# Altium project Fruit_Box_LED.PrjPcb
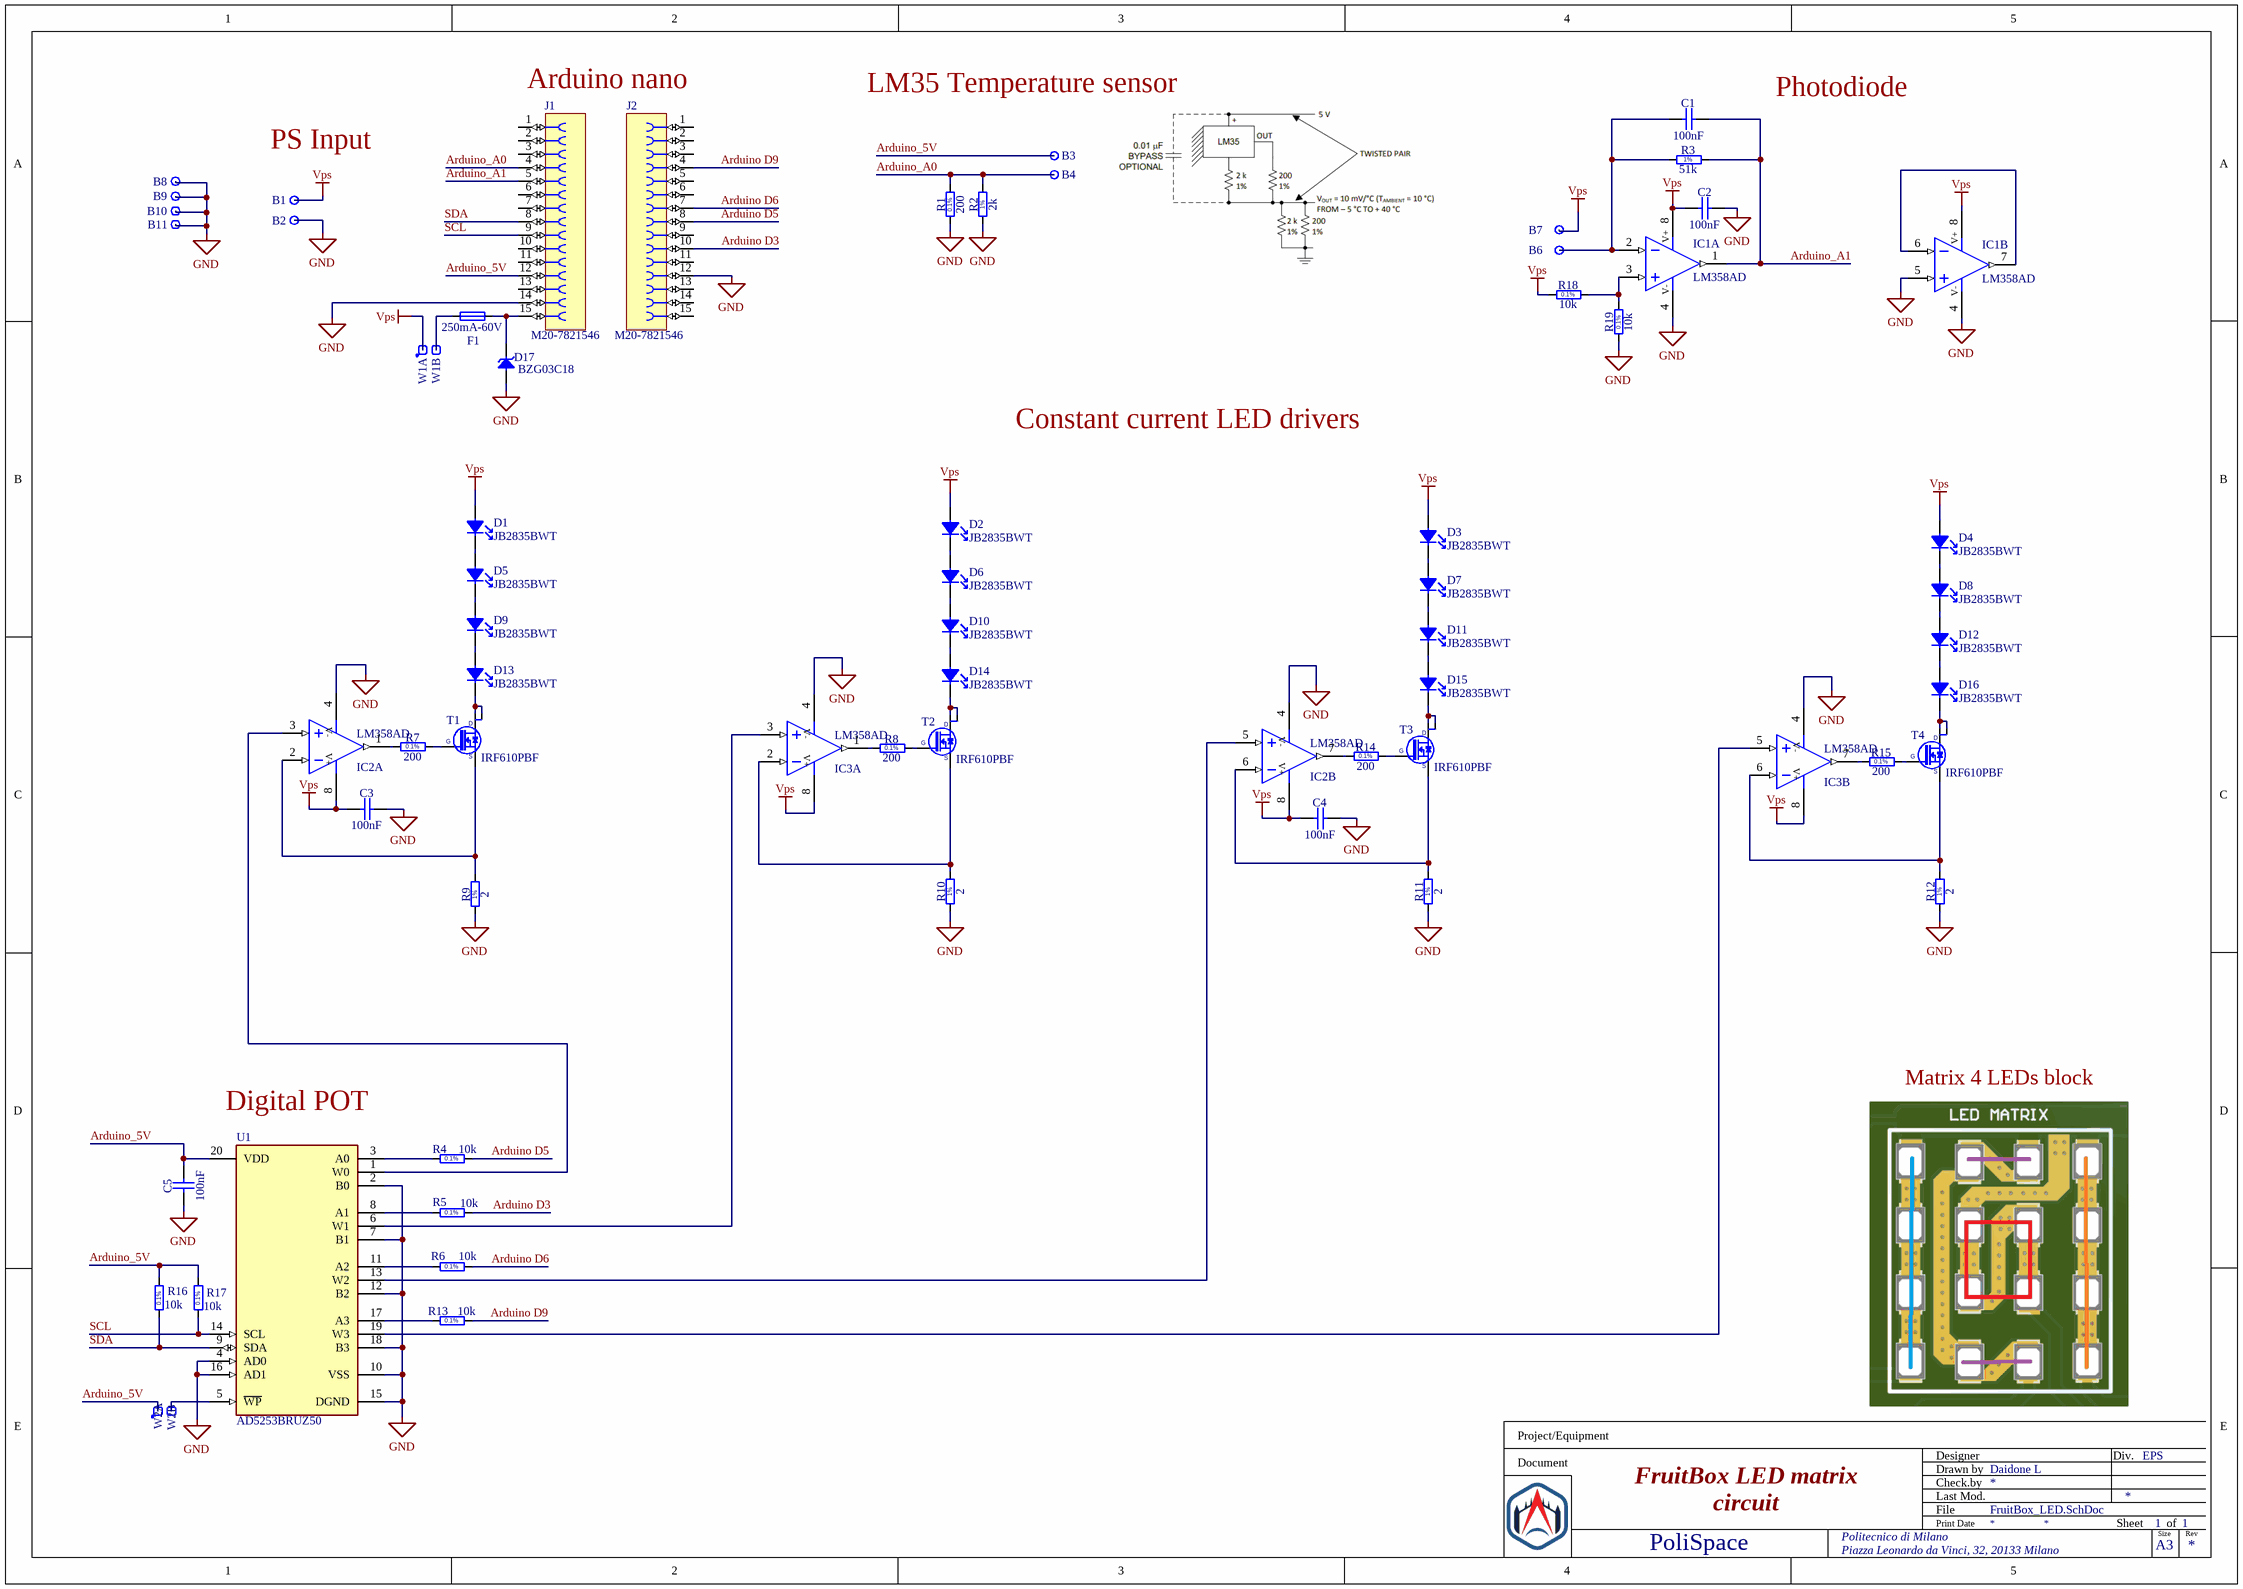
[diagram p0: FruitBox_LED.SchDoc]
CAGE_CODE: ?????; CONTRACT_NUMBER: <CONTRACT NO>; DOC_NO_ASSY_DWG: <ASSY DWG NO>; DOC_NO_BOM: <BOM DOC NO>; DOC_NO_FAB_DWG: <FAB DWG NO>; DOC_NO_SCH_DWG: <SCH DWG NO>; PCB_2_DEC_TOL: +/-.01; PCB_3_DEC_TOL: +/-.010; PCB_ANG_TOL: +/-1/2; PCB_ASSEMBLY_NO: <PCB ASSY NO>; PCB_CHECKER: - -----; PCB_CHECKER_APP_DATE: --/--/----; PCB_DESIGNER: - -----; PCB_DESIGNER_APP_DATE: --/--/----; PCB_DWG_NO: <PCB DWG NO>; PCB_ENGINEER: - -----; PCB_ENGINEER_APP_DATE: --/--/----; PCB_PART_NUMBER: <PCB PN>; PCB_REV: A; SCH_REV: A
1 sheet, 64 parts. Net scope: global (net labels, ports and power ports of the same name join across sheets).
Board file: FruitBox_LED.PcbDoc

## Sheet FruitBox_LED.SchDoc: FruitBox LED matrix
size 420 x 297 mm; DrawnBy: Daidone L; SheetNumber: 1; SheetTotal: 1; Title2: circuit; Project: 6S CubeSat; ENG_APP_DATE: --/--/--; DSN_APP_DATE: --/--/--; CHK_APP_DATE: --/--/--

### Parts
B1  Banana  [CINCH_105-2202-201]  (value not drawn)
B2  Banana  [CINCH_105-2203-201]  (value not drawn)
B3  Plated Hole  [c130h80]  (value not drawn)  (no BOM)
B4  Plated Hole  [c130h80]  (value not drawn)  (no BOM)
B6  Plated Hole  [c130h80]  (value not drawn)  (no BOM)
B7  Plated Hole  [c130h80]  (value not drawn)  (no BOM)
B8  Plated Hole  [MTG320_550]  (value not drawn)  (no BOM)
B9  Plated Hole  [MTG320_550]  (value not drawn)  (no BOM)
B10  Plated Hole  [MTG320_550]  (value not drawn)  (no BOM)
B11  Plated Hole  [MTG320_550]  (value not drawn)  (no BOM)
C1  100nF  [CAPC1608X87N]
C2  100nF  [CAPC1608X87N]
C3  100nF  [CAPC1608X87N]
C4  100nF  [CAPC1608X87N]
C5  100nF  [CAPC1608X87N]
D1  JB2835BWT  [JB2835BWT]
D2  JB2835BWT  [JB2835BWT]
D3  JB2835BWT  [JB2835BWT]
D4  JB2835BWT  [JB2835BWT]
D5  JB2835BWT  [JB2835BWT]
D6  JB2835BWT  [JB2835BWT]
D7  JB2835BWT  [JB2835BWT]
D8  JB2835BWT  [JB2835BWT]
D9  JB2835BWT  [JB2835BWT]
D10  JB2835BWT  [JB2835BWT]
D11  JB2835BWT  [JB2835BWT]
D12  JB2835BWT  [JB2835BWT]
D13  JB2835BWT  [JB2835BWT]
D14  JB2835BWT  [JB2835BWT]
D15  JB2835BWT  [JB2835BWT]
D16  JB2835BWT  [JB2835BWT]
D17  BZG03C18  [DIOM5326X230N]
F1  250mA-60V  [FUSR_BEL_0ZCJ0010FF2E]
IC1  LM358AD  [SOIC127P600X175-8N]  (parts A,B of 2)
IC2  LM358AD  [SOIC127P600X175-8N]  (parts A,B of 2)
IC3  LM358AD  [SOIC127P600X175-8N]  (parts A,B of 2)
J1  M20-7821546  [M20-7821546]
J2  M20-7821546  [M20-7821546]
R1  200  [RESC1608X64N]
R2  2k  [RESC1608X55N]
R3  51k  [RESC2012X60N]
R4  10k  [RESC1608X64N]
R5  10k  [RESC1608X64N]
R6  10k  [RESC1608X64N]
R7  200  [RESC1608X64N]
R8  200  [RESC1608X64N]
R9  2  [RES1016-630X250]
R10  2  [RES1016-630X250]
R11  2  [RES1016-630X250]
R12  2  [RES1016-630X250]
R13  10k  [RESC1608X64N]
R14  200  [RESC1608X64N]
R15  200  [RESC1608X64N]
R16  10k  [RESC1608X64N]
R17  10k  [RESC1608X64N]
R18  10k  [RESC1608X64N]
R19  10k  [RESC1608X64N]
T1  IRF610PBF  [TO-220-H]
T2  IRF610PBF  [TO-220-H]
T3  IRF610PBF  [TO-220-H]
T4  IRF610PBF  [TO-220-H]
U1  AD5253BRUZ50  [FP-RU-20-IPC_C]
W1  Header 2  [HARWIN_M20-9990246]  (value not drawn)  (parts A,B of 2)
W2  Header 2  [HARWIN_M20-9990246]  (value not drawn)  (parts A,B of 2)

### Nets
GND: B2.1 B8.1 B9.1 B10.1 B11.1 C2.2 C3.2 C4.2 C5.2 D17.2(A) IC1.4(V-) IC1.5(IN+) IC2.4(V-) IC3.4(V-) J1.14 J2.12 R1.1 R2.1 R9.1 R10.1 R11.1 R12.1 R19.1 U1.2(B0) U1.4(AD0) U1.7(B1) U1.10(VSS) U1.12(B2) U1.15(DGND) U1.16(AD1) U1.18(B3)
Vps: B1.1 B7.1 C2.1 C3.1 C4.1 D1.2(A) D2.2(A) D3.2(A) D4.2(A) IC1.8(V+) IC2.8(V+) IC3.8(V+) R18.1 W1.1
Arduino D3: J2.10 R5.1
Arduino D5: J2.8 R4.1
Arduino D6: J2.7 R6.1
Arduino D9: J2.4 R13.1
Arduino_5V: B3.1 C5.1 J1.12 R16.2 R17.2 U1.20(VDD) W2.1
Arduino_A0: B4.1 J1.4 R1.2 R2.2
Arduino_A1: C1.2 IC1.1(OUT) J1.5 R3.2
SCL: J1.9 R17.1 U1.14(SCL)
SDA: J1.8 R16.1 U1.9(SDA)
NetB6_1: B6.1 C1.1 IC1.2(IN-) R3.1
NetD1_1: D1.1(C) D5.2(A)
NetD2_1: D2.1(C) D6.2(A)
NetD3_1: D3.1(C) D7.2(A)
NetD4_1: D4.1(C) D8.2(A)
NetD5_1: D5.1(C) D9.2(A)
NetD6_1: D6.1(C) D10.2(A)
NetD7_1: D7.1(C) D11.2(A)
NetD8_1: D8.1(C) D12.2(A)
NetD9_1: D9.1(C) D13.2(A)
NetD10_1: D10.1(C) D14.2(A)
NetD11_1: D11.1(C) D15.2(A)
NetD12_1: D12.1(C) D16.2(A)
NetD13_1: D13.1(C) T1.2(D) T1.4(D)
NetD14_1: D14.1(C) T2.2(D) T2.4(D)
NetD15_1: D15.1(C) T3.2(D) T3.4(D)
NetD16_1: D16.1(C) T4.2(D) T4.4(D)
NetD17_1: D17.1(C) F1.2 J1.15
NetF1_1: F1.1 W1.2
NetIC1_3: IC1.3(IN+) R18.2 R19.2
NetIC1_6: IC1.6(IN-) IC1.7(OUT)
NetIC2_1: IC2.1(OUT) R7.1
NetIC2_2: IC2.2(IN-) R9.2 T1.3(S)
NetIC2_3: IC2.3(IN+) U1.1(W0)
NetIC2_5: IC2.5(IN+) U1.13(W2)
NetIC2_6: IC2.6(IN-) R11.2 T3.3(S)
NetIC2_7: IC2.7(OUT) R14.1
NetIC3_1: IC3.1(OUT) R8.1
NetIC3_2: IC3.2(IN-) R10.2 T2.3(S)
NetIC3_3: IC3.3(IN+) U1.6(W1)
NetIC3_5: IC3.5(IN+) U1.19(W3)
NetIC3_6: IC3.6(IN-) R12.2 T4.3(S)
NetIC3_7: IC3.7(OUT) R15.1
NetR4_2: R4.2 U1.3(A0)
NetR5_2: R5.2 U1.8(A1)
NetR6_2: R6.2 U1.11(A2)
NetR7_2: R7.2 T1.1(G)
NetR8_2: R8.2 T2.1(G)
NetR13_2: R13.2 U1.17(A3)
NetR14_2: R14.2 T3.1(G)
NetR15_2: R15.2 T4.1(G)
NetU1_5: U1.5(~{WP}) W2.2

Not connected (* = marked no-connect by the designer): J1 1 2 3 6 7 10 11 13; J2 1 2 3 5 6 9 11 13 14 15

### Notes on the sheet
- Arduino nano
- LM35 Temperature sensor
- Photodiode
- PS Input
- Constant current LED drivers
- (near U1) Digital POT
- Matrix 4 LEDs block
- Project/Equipment
- Document
- Designer
- Drawn by
- Check.by
- Div.
- EPS
- PoliSpace
- Politecnico di Milano
- File
- Last Mod.
- Print Date
- Sheet
- Size
- A3
- of
- Rev
- Piazza Leonardo da Vinci, 32, 20133 Milano
- (in symbol R0603_2K_1%_0.1W_100PPM) 1%
- (in symbol R0603_10K_0.1%_0.1W_25PPM) 0.1%
- (in symbol R0603_200R_0.1%_0.1W_25PPM) 0.1%
- (in symbol R0805_51K_1%_0.125W_100PPM) 1%
- (in symbol RMF_2R_1%_0.6W_50PPM_1016-630X250) 1%

### Library data of the parts
B1 = CINCH_105-2202-201: Single Terminal Socket; Part Description: Red Tip Jack, Vertical For Banana 2mm; Manufacturer: CINCH CONNECTIVITY; PressFit: No; Part Number: CINCH_105-2202-201; Component Kind: Standard; Component Type: Standard; Pin Count: 1; Family: Banana; Mounted: Yes; Socket: No; SMD: No; Sense: No; Status: None; Manufacturer Part Number: 105-2202-201; ComponentHeight: 8.26mm; HelpURL: \\cern.ch\dfs\Applications\Altium\Datasheets\CINCH_105-22XX-201.pdf; Author: CERN DEM MR; CreateDate: 23-Feb-16; LatestRevisionDate: 23-Feb-16
B2 = CINCH_105-2203-201: Single Terminal Socket; Part Description: Black Tip Jack, Vertical For Banana 2mm; Manufacturer: CINCH CONNECTIVITY; PressFit: No; Part Number: CINCH_105-2203-201; Component Kind: Standard; Component Type: Standard; Pin Count: 1; Family: Banana; Mounted: Yes; Socket: No; SMD: No; Sense: No; Status: None; Manufacturer Part Number: 105-2203-201; ComponentHeight: 8.26mm; HelpURL: \\cern.ch\dfs\Applications\Altium\Datasheets\CINCH_105-22XX-201.pdf; Author: CERN DEM MR; CreateDate: 23-Feb-16; LatestRevisionDate: 23-Feb-16
B3 B4 B6 B7 = PLATED_HOLE0.8_PAD1.3: Single Terminal Socket; Part Description: Plated Through Hole: Hole Dia.=0.8mm Pad Dia.=1.3mm, IPC-7251 Level C; Mounted: No; Part Number: PLATED_HOLE0.8_PAD1.3; Component Type: Standard (No BOM); Pin Count: 1; Family: Plated Hole; Socket: No; SMD: No; Sense: No; Status: None; ComponentHeight: 0mm; HelpURL: Undefined; Author: CERN DEM JLC; CreateDate: 30-Oct-08; LatestRevisionDate: 30-Oct-08; PackageDescription: Plated Through Hole: Hole Dia.=0.8mm Pad Dia.=1.3mm, IPC-7251 Level C
B8-B11 = PLATED_HOLE3.2_PAD5.5: Single Terminal Socket; Part Description: Plated Through Hole: Hole Dia.=3.2mm Pad Dia.=5.5mm; Mounted: No; Part Number: PLATED_HOLE3.2_PAD5.5; Component Type: Standard (No BOM); Pin Count: 1; Family: Plated Hole; Socket: No; SMD: No; Sense: No; Status: None; ComponentHeight: 0mm; HelpURL: Undefined; Author: CERN DEM JMW; CreateDate: 01-Oct-12; LatestRevisionDate: 01-Oct-12; PackageDescription: Plated Through Hole: Hole Dia.=3.2mm Pad Dia.=5.5mm
C1-C5 = CC0603_100NF_50V_10%_X7R: Non-polarised capacitor; Part Description: SMD Multilayer Chip Ceramic Capacitor; Manufacturer: GENERIC; Manufacturer1 Part Number: 223858615649; Voltage: 50V; TC: X7R; Tolerance: ±10%; Part Number: CC0603_100NF_50V_10%_X7R; Component Kind: Standard; Component Type: Standard; Pin Count: 2; Value: 100nF; Status: Preferred; Manufacturer Part Number: CC0603_100NF_50V_10%_X7R; Case: 0603; Mounted: Yes; Socket: No; SMD: Yes; Sense: No; Manufacturer1 Example: PHYCOMP; Manufacturer1 ComponentHeight: 0.87mm; HelpURL: \\cern.ch\dfs\Applications\Altium\Datasheets\CC0603_X7R_PHYCOMP.pdf; Author: CERN DEM JLC; CreateDate: 03-Dec-07; LatestRevisionDate: 03-Dec-07
D1-D16 = JB2835BWT-G-U35GA0000
D17 = BZG03C18: Zener Diode; Part Description: Voltage Regulator Diode; Manufacturer: VISHAY SEMICONDUCTORS; Voltage: 18V; Power: 1.25W; PressFit: No; Bonding: No; Part Number: BZG03C18; Component Kind: Standard; Component Type: Standard; Device: BZG03C18; PackageDescription: DO-214-AC/SMA Molded Diode, Body 5.3x2.6mm, IPC Medium Density; Manufacturer Part Number: BZG03C18; Pin Count: 2; Case: DO-214AC; Mounted: Yes; Socket: No; SMD: Yes; Sense: No; ComponentHeight: 2.3mm; HelpURL: \\cern.ch\dfs\Applications\Altium\Datasheets\BZG03C.pdf; Author: CERN DEM JLC; CreateDate: 02-Jun-08; LatestRevisionDate: 02-Jun-08
F1 = FUSR1206_BEL_0ZCJ0010FF2E: Fuse; Part Description: Surface Mount PTC Resettable Fuse,  OZCJ Series; Manufacturer: BEL; PressFit: No; Part Number: FUSR1206_BEL_0ZCJ0010FF2E; Component Kind: Standard; Component Type: Standard; Pin Count: 2; PackageDescription: 1206 (3216mm), Body 3.25 x 1.65mm, Surface Mount PTC Resettable Fuse,  OZCJ Series; Family: Fuses Resettable; Mounted: Yes; Socket: No; SMD: Yes; Sense: No; Value: 250mA-60V; Manufacturer Part Number: 0ZCJ0010FF2E; ComponentHeight: 0.85mm; HelpURL: \\cern.ch\dfs\Applications\Altium\Datasheets\FUSR_BEL_0ZCJ.pdf; Author: CERN DEM BR; CreateDate: 20-May-19; LatestRevisionDate: 20-May-19
IC1-IC3 = LM358AD: Dual Operational Amplifier; Manufacturer: TEXAS INSTRUMENTS; PressFit: No; Bonding: No; Part Number: LM358AD; Component Kind: Standard; Component Type: Standard; Device: LM358AD; PackageDescription: SOIC 8, Pitch 1.27mm - Body 4x5mm, IPC Medium Density; Part Description: Dual Operational Amplifier; Manufacturer Part Number: LM358AD; Pin Count: 8; Case: SOIC8; Mounted: Yes; Socket: No; SMD: Yes; Sense: No; ComponentHeight: 1.75mm; Author: CERN DEM JLC; HelpURL: \\cern.ch\dfs\Applications\Altium\Datasheets\LM358AD.pdf; CreateDate: 02-Dec-08; LatestRevisionDate: 13-Apr-10
R1 R7 R8 R14 R15 = R0603_200R_0.1%_0.1W_25PPM: Resistor - 0.1%; Part Description: Thin Film Chip Resistor; Manufacturer: GENERIC; Manufacturer1 Part Number: ERA3AEB201V; Power: 0.1W; TC: ±25ppm/°C; PressFit: No; Part Number: R0603_200R_0.1%_0.1W_25PPM; Component Kind: Standard; Component Type: Standard; Pin Count: 2; Value: 200; Status: Not Recommended; Tolerance: ±0.1%; Manufacturer Part Number: R0603_200R_0.1%_0.1W_25PPM; Case: 0603; Mounted: Yes; Sense: No; Socket: No; SMD: Yes; Manufacturer1 Example: PANASONIC; Manufacturer1 ComponentHeight: 0.55mm; HelpURL: \\cern.ch\dfs\Applications\Altium\Datasheets\R0603_PANASONIC_ERA.pdf; Author: CERN DEM JLC; CreateDate: 12-Jan-17; LatestRevisionDate: 12-Jan-17
R2 = R0603_2K_1%_0.1W_100PPM: Resistor - 1%; Part Description: General Purpose Thick Film Chip Resistor; Manufacturer: GENERIC; Manufacturer1 Part Number: NRC06F2001TRF; Power: 0.1W; TC: ±100ppm/°C; PressFit: No; Part Number: R0603_2K_1%_0.1W_100PPM; Component Kind: Standard; Component Type: Standard; Pin Count: 2; Value: 2k; Status: Preferred; Tolerance: ±1%; Manufacturer Part Number: R0603_2K_1%_0.1W_100PPM; Case: 0603; Mounted: Yes; Sense: No; Socket: No; SMD: Yes; Manufacturer1 Example: NIC COMPONENT; Manufacturer1 ComponentHeight: 0.55mm; HelpURL: \\cern.ch\dfs\Applications\Altium\Datasheets\R0603_NIC_NRC.pdf; Author: CERN DEM JLC; CreateDate: 03-Dec-07; LatestRevisionDate: 13-Mar-08
R3 = R0805_51K_1%_0.125W_100PPM: Resistor - 1%; Part Description: General Purpose Thick Film Chip Resistor; Manufacturer: GENERIC; Manufacturer1 Part Number: NRC10F5102TRF; Power: 0.125W; TC: ±100ppm/°C; PressFit: No; Part Number: R0805_51K_1%_0.125W_100PPM; Component Kind: Standard; Component Type: Standard; Pin Count: 2; Value: 51k; Status: Preferred; Tolerance: ±1%; Manufacturer Part Number: R0805_51K_1%_0.125W_100PPM; Case: 0805; Mounted: Yes; Sense: No; Socket: No; SMD: Yes; Manufacturer1 Example: NIC COMPONENT; Manufacturer1 ComponentHeight: 0.6mm; HelpURL: \\cern.ch\dfs\Applications\Altium\Datasheets\R0805_NIC_NRC.pdf; Author: CERN DEM JLC; CreateDate: 03-Dec-07; LatestRevisionDate: 13-Mar-08
R4-R6 R13 R16-R19 = R0603_10K_0.1%_0.1W_25PPM: Resistor - 0.1%; Part Description: Thin Film Chip Resistor; Manufacturer: GENERIC; Manufacturer1 Part Number: ERA3AEB103V; Power: 0.1W; TC: ±25ppm/°C; PressFit: No; Part Number: R0603_10K_0.1%_0.1W_25PPM; Component Kind: Standard; Component Type: Standard; Pin Count: 2; Value: 10k; Status: Not Recommended; Tolerance: ±0.1%; Manufacturer Part Number: R0603_10K_0.1%_0.1W_25PPM; Case: 0603; Mounted: Yes; Sense: No; Socket: No; SMD: Yes; Manufacturer1 Example: PANASONIC; Manufacturer1 ComponentHeight: 0.55mm; HelpURL: \\cern.ch\dfs\Applications\Altium\Datasheets\R0603_PANASONIC_ERA.pdf; Author: CERN DEM JMW; CreateDate: 09-Nov-15; LatestRevisionDate: 11-Jan-17
R9-R12 = RMF_2R_1%_0.6W_50PPM_1016-630X250: Resistor - 1%; Part Description: Leaded Metal Film Resistor; Manufacturer: GENERIC; Manufacturer1 Part Number: MBB02070C2008FCT00; Power: 0.6W; TC: ±50ppm/°C; PressFit: No; Part Number: RMF_2R_1%_0.6W_50PPM_1016-630X250; Component Kind: Standard; Component Type: Standard; Pin Count: 2; Value: 2; Status: Preferred; Tolerance: ±1%; Manufacturer Part Number: RMF_2R_1%_0.6W_50PPM_1016-630X250; Case: LS10.16 L6.3 x D2.5; Mounted: Yes; Sense: No; Socket: No; SMD: No; ComponentHeight: 2.5mm; Manufacturer1 Example: VISHAY BEYSCHLAG; Manufacturer1 ComponentHeight: 2.5mm; HelpURL: \\cern.ch\dfs\Applications\Altium\Datasheets\RMF_VISHAY_MBB0207.pdf; Author: CERN DEM JLC; CreateDate: 04-Dec-07; LatestRevisionDate: 07-Apr-08
T1-T4 = IRF610PBF_h: N-CHANNEL MOSFET WITH DIODE AND 2 DRAIN; Part Description: 200V 3.3A N-Channel Power MOSFET; Manufacturer: VISHAY SILICONIX; PressFit: No; Bonding: No; Part Number: IRF610PBF_h; Component Kind: Standard; Component Type: Standard; Device: IRF610PBF; PackageDescription: TO-220 3-Terminal + Tab - Horizontal; Manufacturer Part Number: IRF610PBF; Pin Count: 4; Case: TO-220; Mounted: Yes; Socket: No; SMD: No; Sense: No; ComponentHeight: 4.69mm; HelpURL: \\cern.ch\dfs\Applications\Altium\Datasheets\IRF610PBF.pdf; Author: CERN DEM JLC; CreateDate: 29-May-18; LatestRevisionDate: 29-May-18
U1 = CMP-09083-000126-1: IC DGTL POT 50KOHM 64TAP 20TSSOP; -3db Bandwidth: 4MHz; Operating Supply Voltage: 2.75V; Number of Circuits: 4; Supply Current: 3uA; Frequency: 400kHz; Resistance Tolerance: 20%; Resistance: 50kR; Min Supply Voltage: 2.7V; Number of Positions: 64; Min Dual Supply Voltage: 2.25V; Dual Supply Voltage: 2.5V; Interface: I2C; Quiescent Current: 5uA; Max Supply Voltage: 5.5V; Temperature Coefficient: 300ppm/°C; Memory Type: Non-Volatile; REACH SVHC: No SVHC; Series: -; Case/Package: TSSOP; Package Quantity: 75; Max Operating Temperature: 85°C; Nominal Supply Current: 3uA; Number of Elements: 4; Taper: Linear; Mount: Surface Mount; Length: 6.5mm; Min Operating Temperature: -40°C; Number of Taps: 64; Number of Channels: 4; Contact Plating: Tin; Packaging: Rail/Tube; Tolerance: 20%; Height: 1.05mm; Lead Free: Contains Lead; Max Supply Current: 5uA; RoHS Compliant: Yes; Width: 4.4mm; Operating Supply Current: 3uA; Number of Pins: 20; Termination: SMD/SMT; Max Dual Supply Voltage: 2.75V
W1 W2 = HARWIN_M20-9990246: 2 Mini Wire-Wrap Contact Strip Header; Part Description: 2 Contacts SIL Vertical Pin Header, Pitch 2.54mm, Mating Height 6.1mm, Insulator 2.54mm; Manufacturer: HARWIN; PressFit: No; Part Number: HARWIN_M20-9990246; Component Kind: Standard; Component Type: Standard; Pin Count: 2; Family: Header 2; Mounted: Yes; Socket: No; SMD: No; Sense: No; Status: None; Manufacturer Part Number: M20-9990246; ComponentHeight: 8.68mm; HelpURL: \\cern.ch\dfs\Applications\Altium\Datasheets\HARWIN_M20-9990246.pdf; Author: CERN DEM JLC; CreateDate: 01-Jun-11; LatestRevisionDate: 01-Jun-11